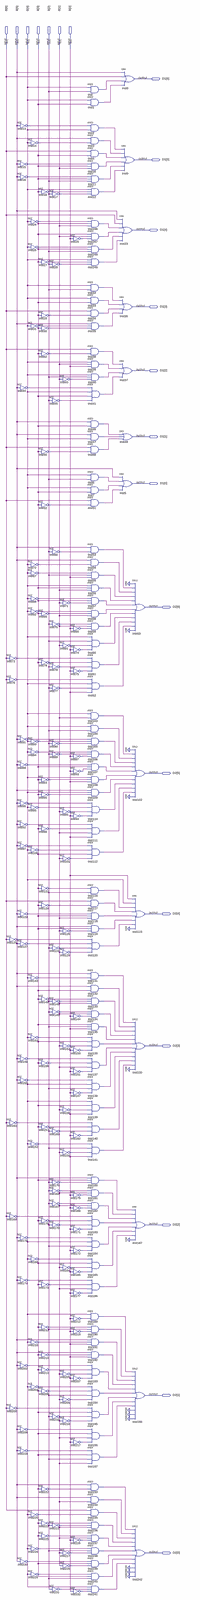
[diagram p0: schematic sheet, whole]
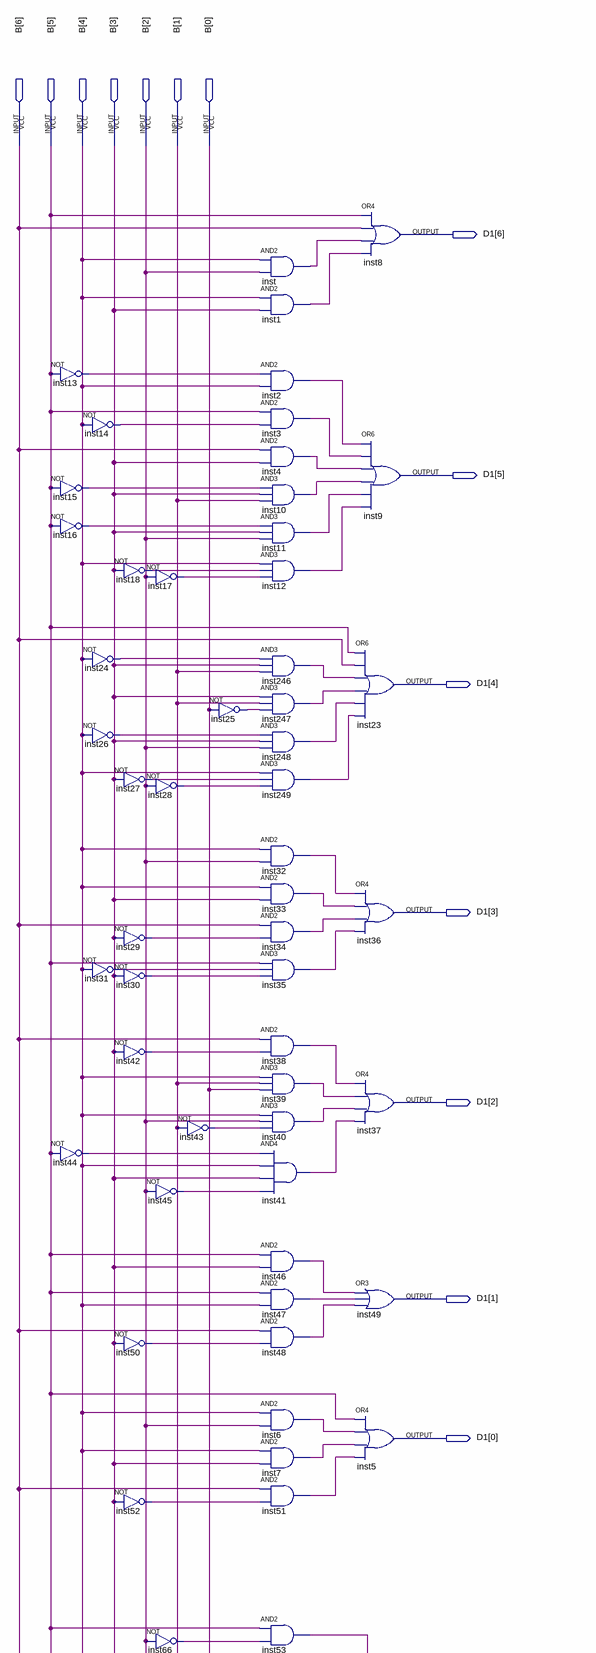
[diagram p1: schematic sheet, upper part]
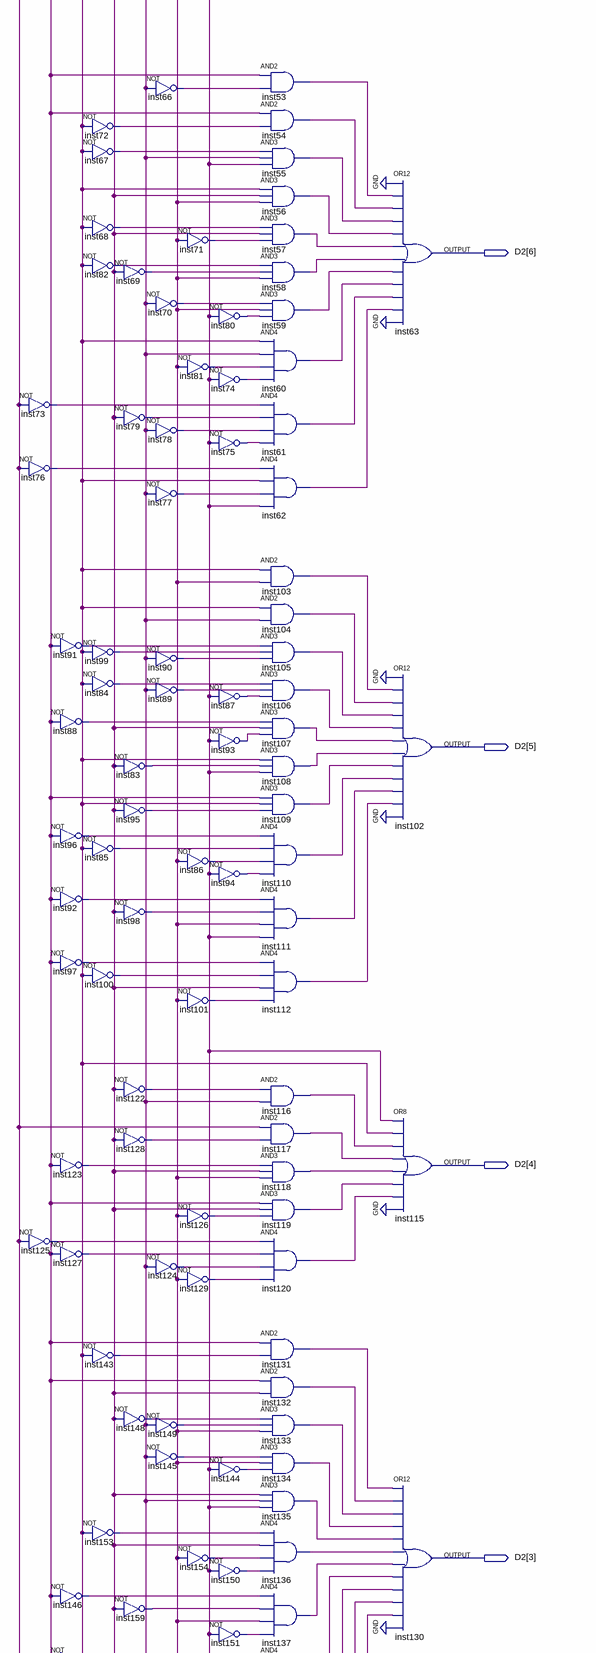
[diagram p2: schematic sheet, middle part]
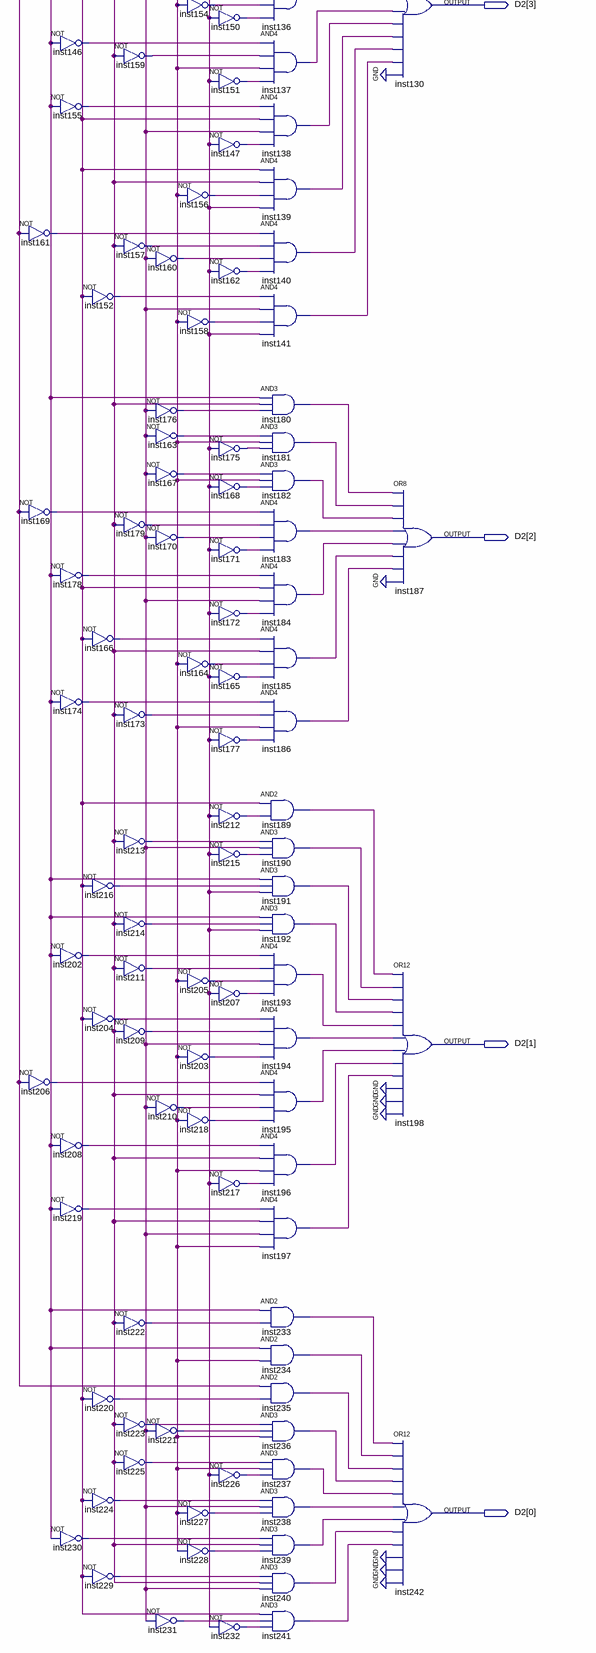
[diagram p3: schematic sheet, lower part]
// Quartus schematic BlockTABELINEA.bdf as structural Verilog: 233 symbols, 21 pins
module BlockTABELINEA (
  input  [6:0] B,
  output [6:0] D1,
  output [6:0] D2
);

  wire inst1_out, inst2_out, inst3_out, inst4_out, inst6_out, inst7_out, inst10_out, inst11_out, inst12_out,
       inst13_out, inst14_out, inst15_out, inst16_out, inst17_out, inst18_out, inst24_out, inst25_out,
       inst26_out, inst27_out, inst28_out, inst29_out, inst30_out, inst31_out, inst32_out, inst33_out,
       inst34_out, inst35_out, inst38_out, inst39_out, inst40_out, inst41_out, inst42_out, inst43_out,
       inst44_out, inst45_out, inst46_out, inst47_out, inst48_out, inst50_out, inst51_out, inst52_out,
       inst53_out, inst54_out, inst55_out, inst56_out, inst57_out, inst58_out, inst59_out, inst60_out,
       inst61_out, inst62_out, inst66_out, inst67_out, inst68_out, inst69_out, inst70_out, inst71_out,
       inst72_out, inst73_out, inst74_out, inst75_out, inst76_out, inst77_out, inst78_out, inst79_out,
       inst80_out, inst81_out, inst82_out, inst83_out, inst84_out, inst85_out, inst86_out, inst87_out,
       inst88_out, inst89_out, inst90_out, inst91_out, inst92_out, inst93_out, inst94_out, inst95_out,
       inst96_out, inst97_out, inst98_out, inst99_out, inst100_out, inst101_out, inst103_out, inst104_out,
       inst105_out, inst106_out, inst107_out, inst108_out, inst109_out, inst110_out, inst111_out,
       inst112_out, inst116_out, inst117_out, inst118_out, inst119_out, inst120_out, inst122_out,
       inst123_out, inst124_out, inst125_out, inst126_out, inst127_out, inst128_out, inst129_out,
       inst131_out, inst132_out, inst133_out, inst134_out, inst135_out, inst136_out, inst137_out,
       inst138_out, inst139_out, inst140_out, inst141_out, inst143_out, inst144_out, inst145_out,
       inst146_out, inst147_out, inst148_out, inst149_out, inst150_out, inst151_out, inst152_out,
       inst153_out, inst154_out, inst155_out, inst156_out, inst157_out, inst158_out, inst159_out,
       inst160_out, inst161_out, inst162_out, inst163_out, inst164_out, inst165_out, inst166_out,
       inst167_out, inst168_out, inst169_out, inst170_out, inst171_out, inst172_out, inst173_out,
       inst174_out, inst175_out, inst176_out, inst177_out, inst178_out, inst179_out, inst180_out,
       inst181_out, inst182_out, inst183_out, inst184_out, inst185_out, inst186_out, inst189_out,
       inst190_out, inst191_out, inst192_out, inst193_out, inst194_out, inst195_out, inst196_out,
       inst197_out, inst202_out, inst203_out, inst204_out, inst205_out, inst206_out, inst207_out,
       inst208_out, inst209_out, inst210_out, inst211_out, inst212_out, inst213_out, inst214_out,
       inst215_out, inst216_out, inst217_out, inst218_out, inst219_out, inst220_out, inst221_out,
       inst222_out, inst223_out, inst224_out, inst225_out, inst226_out, inst227_out, inst228_out,
       inst229_out, inst230_out, inst231_out, inst232_out, inst233_out, inst234_out, inst235_out,
       inst236_out, inst237_out, inst238_out, inst239_out, inst240_out, inst241_out, inst246_out,
       inst247_out, inst248_out, inst249_out, inst_out;

  not inst13 (inst13_out, B[5]);
  not inst15 (inst15_out, B[5]);
  not inst16 (inst16_out, B[5]);
  not inst44 (inst44_out, B[5]);
  not inst73 (inst73_out, B[6]);
  not inst76 (inst76_out, B[6]);
  not inst91 (inst91_out, B[5]);
  not inst88 (inst88_out, B[5]);
  not inst96 (inst96_out, B[5]);
  not inst92 (inst92_out, B[5]);
  not inst97 (inst97_out, B[5]);
  not inst123 (inst123_out, B[5]);
  not inst125 (inst125_out, B[6]);
  not inst127 (inst127_out, B[5]);
  not inst146 (inst146_out, B[5]);
  not inst155 (inst155_out, B[5]);
  not inst161 (inst161_out, B[6]);
  not inst169 (inst169_out, B[6]);
  not inst178 (inst178_out, B[5]);
  not inst174 (inst174_out, B[5]);
  not inst202 (inst202_out, B[5]);
  not inst206 (inst206_out, B[6]);
  not inst208 (inst208_out, B[5]);
  not inst219 (inst219_out, B[5]);
  not inst230 (inst230_out, B[5]);
  not inst14 (inst14_out, B[4]);
  not inst24 (inst24_out, B[4]);
  not inst26 (inst26_out, B[4]);
  not inst31 (inst31_out, B[4]);
  not inst72 (inst72_out, B[4]);
  not inst67 (inst67_out, B[4]);
  not inst68 (inst68_out, B[4]);
  not inst82 (inst82_out, B[4]);
  not inst99 (inst99_out, B[4]);
  not inst84 (inst84_out, B[4]);
  not inst85 (inst85_out, B[4]);
  not inst100 (inst100_out, B[4]);
  not inst143 (inst143_out, B[4]);
  not inst153 (inst153_out, B[4]);
  not inst152 (inst152_out, B[4]);
  not inst166 (inst166_out, B[4]);
  not inst216 (inst216_out, B[4]);
  not inst204 (inst204_out, B[4]);
  not inst220 (inst220_out, B[4]);
  not inst224 (inst224_out, B[4]);
  not inst229 (inst229_out, B[4]);
  not inst18 (inst18_out, B[3]);
  not inst17 (inst17_out, B[2]);
  not inst27 (inst27_out, B[3]);
  not inst28 (inst28_out, B[2]);
  not inst29 (inst29_out, B[3]);
  not inst30 (inst30_out, B[3]);
  not inst42 (inst42_out, B[3]);
  not inst45 (inst45_out, B[2]);
  not inst50 (inst50_out, B[3]);
  not inst52 (inst52_out, B[3]);
  not inst66 (inst66_out, B[2]);
  not inst69 (inst69_out, B[3]);
  not inst70 (inst70_out, B[2]);
  not inst79 (inst79_out, B[3]);
  not inst78 (inst78_out, B[2]);
  not inst77 (inst77_out, B[2]);
  not inst90 (inst90_out, B[2]);
  not inst89 (inst89_out, B[2]);
  not inst83 (inst83_out, B[3]);
  not inst95 (inst95_out, B[3]);
  not inst98 (inst98_out, B[3]);
  not inst122 (inst122_out, B[3]);
  not inst128 (inst128_out, B[3]);
  not inst124 (inst124_out, B[2]);
  not inst148 (inst148_out, B[3]);
  not inst149 (inst149_out, B[2]);
  not inst145 (inst145_out, B[2]);
  not inst159 (inst159_out, B[3]);
  not inst157 (inst157_out, B[3]);
  not inst160 (inst160_out, B[2]);
  not inst176 (inst176_out, B[2]);
  not inst163 (inst163_out, B[2]);
  not inst167 (inst167_out, B[2]);
  not inst179 (inst179_out, B[3]);
  not inst170 (inst170_out, B[2]);
  not inst173 (inst173_out, B[3]);
  not inst213 (inst213_out, B[3]);
  not inst214 (inst214_out, B[3]);
  not inst211 (inst211_out, B[3]);
  not inst209 (inst209_out, B[3]);
  not inst210 (inst210_out, B[2]);
  not inst222 (inst222_out, B[3]);
  not inst223 (inst223_out, B[3]);
  not inst221 (inst221_out, B[2]);
  not inst225 (inst225_out, B[3]);
  not inst231 (inst231_out, B[2]);
  not inst43 (inst43_out, B[1]);
  not inst71 (inst71_out, B[1]);
  not inst81 (inst81_out, B[1]);
  not inst86 (inst86_out, B[1]);
  not inst101 (inst101_out, B[1]);
  not inst126 (inst126_out, B[1]);
  not inst129 (inst129_out, B[1]);
  not inst154 (inst154_out, B[1]);
  not inst156 (inst156_out, B[1]);
  not inst158 (inst158_out, B[1]);
  not inst164 (inst164_out, B[1]);
  not inst205 (inst205_out, B[1]);
  not inst203 (inst203_out, B[1]);
  not inst218 (inst218_out, B[1]);
  not inst227 (inst227_out, B[1]);
  not inst228 (inst228_out, B[1]);
  not inst25 (inst25_out, B[0]);
  not inst80 (inst80_out, B[0]);
  not inst74 (inst74_out, B[0]);
  not inst75 (inst75_out, B[0]);
  not inst87 (inst87_out, B[0]);
  not inst93 (inst93_out, B[0]);
  not inst94 (inst94_out, B[0]);
  not inst144 (inst144_out, B[0]);
  not inst150 (inst150_out, B[0]);
  not inst151 (inst151_out, B[0]);
  not inst147 (inst147_out, B[0]);
  not inst162 (inst162_out, B[0]);
  not inst175 (inst175_out, B[0]);
  not inst168 (inst168_out, B[0]);
  not inst171 (inst171_out, B[0]);
  not inst172 (inst172_out, B[0]);
  not inst165 (inst165_out, B[0]);
  not inst177 (inst177_out, B[0]);
  not inst212 (inst212_out, B[0]);
  not inst215 (inst215_out, B[0]);
  not inst207 (inst207_out, B[0]);
  not inst217 (inst217_out, B[0]);
  not inst226 (inst226_out, B[0]);
  not inst232 (inst232_out, B[0]);
  and inst (inst_out, B[4], B[2]);
  and inst1 (inst1_out, B[4], B[3]);
  and inst2 (inst2_out, inst13_out, B[4]);
  and inst3 (inst3_out, B[5], inst14_out);
  and inst4 (inst4_out, B[6], B[3]);
  and inst10 (inst10_out, inst15_out, B[3], B[1]);
  and inst11 (inst11_out, inst16_out, B[3], B[2]);
  and inst12 (inst12_out, B[4], inst18_out, inst17_out);
  and inst246 (inst246_out, inst24_out, B[3], B[1]);
  and inst247 (inst247_out, B[3], B[1], inst25_out);
  and inst248 (inst248_out, inst26_out, B[3], B[2]);
  and inst249 (inst249_out, B[4], inst27_out, inst28_out);
  and inst32 (inst32_out, B[4], B[2]);
  and inst33 (inst33_out, B[4], B[3]);
  and inst34 (inst34_out, B[6], inst29_out);
  and inst35 (inst35_out, B[5], inst31_out, inst30_out);
  and inst38 (inst38_out, B[6], inst42_out);
  and inst39 (inst39_out, B[4], B[1], B[0]);
  and inst40 (inst40_out, B[4], B[2], inst43_out);
  and inst41 (inst41_out, inst44_out, B[4], B[3], inst45_out);
  and inst46 (inst46_out, B[5], B[3]);
  and inst47 (inst47_out, B[5], B[4]);
  and inst48 (inst48_out, B[6], inst50_out);
  and inst6 (inst6_out, B[4], B[2]);
  and inst7 (inst7_out, B[4], B[3]);
  and inst51 (inst51_out, B[6], inst52_out);
  and inst53 (inst53_out, B[5], inst66_out);
  and inst54 (inst54_out, B[5], inst72_out);
  and inst55 (inst55_out, inst67_out, B[2], B[0]);
  and inst56 (inst56_out, B[4], B[3], B[1]);
  and inst57 (inst57_out, inst68_out, B[3], inst71_out);
  and inst58 (inst58_out, inst82_out, inst69_out, B[1]);
  and inst59 (inst59_out, inst70_out, B[1], inst80_out);
  and inst60 (inst60_out, B[4], B[2], inst81_out, inst74_out);
  and inst61 (inst61_out, inst73_out, inst79_out, inst78_out, inst75_out);
  and inst62 (inst62_out, inst76_out, B[4], inst77_out, B[0]);
  and inst103 (inst103_out, B[4], B[1]);
  and inst104 (inst104_out, B[4], B[2]);
  and inst105 (inst105_out, inst91_out, inst99_out, inst90_out);
  and inst106 (inst106_out, inst84_out, inst89_out, inst87_out);
  and inst107 (inst107_out, inst88_out, B[3], inst93_out);
  and inst108 (inst108_out, B[4], inst83_out, B[0]);
  and inst109 (inst109_out, B[5], B[4], inst95_out);
  and inst110 (inst110_out, inst96_out, inst85_out, inst86_out, inst94_out);
  and inst111 (inst111_out, inst92_out, inst98_out, B[1], B[0]);
  and inst112 (inst112_out, inst97_out, inst100_out, B[3], inst101_out);
  and inst116 (inst116_out, inst122_out, B[2]);
  and inst117 (inst117_out, B[6], inst128_out);
  and inst118 (inst118_out, inst123_out, B[3], B[1]);
  and inst119 (inst119_out, B[5], B[3], inst126_out);
  and inst120 (inst120_out, inst125_out, inst127_out, inst124_out, inst129_out);
  and inst131 (inst131_out, B[5], inst143_out);
  and inst132 (inst132_out, B[5], B[3]);
  and inst133 (inst133_out, inst148_out, inst149_out, B[1]);
  and inst134 (inst134_out, inst145_out, B[1], inst144_out);
  and inst135 (inst135_out, B[3], B[2], B[0]);
  and inst136 (inst136_out, inst153_out, B[3], inst154_out, inst150_out);
  and inst137 (inst137_out, inst146_out, inst159_out, B[1], inst151_out);
  and inst138 (inst138_out, inst155_out, B[4], B[2], inst147_out);
  and inst139 (inst139_out, B[4], B[3], inst156_out, B[0]);
  and inst140 (inst140_out, inst161_out, inst157_out, inst160_out, inst162_out);
  and inst141 (inst141_out, inst152_out, B[2], inst158_out, B[0]);
  and inst180 (inst180_out, B[5], B[3], inst176_out);
  and inst181 (inst181_out, inst163_out, B[1], inst175_out);
  and inst182 (inst182_out, inst167_out, B[1], inst168_out);
  and inst183 (inst183_out, inst169_out, inst179_out, inst170_out, inst171_out);
  and inst184 (inst184_out, inst178_out, B[4], B[2], inst172_out);
  and inst185 (inst185_out, inst166_out, B[3], inst164_out, inst165_out);
  and inst186 (inst186_out, inst174_out, inst173_out, B[1], inst177_out);
  and inst189 (inst189_out, B[4], inst212_out);
  and inst190 (inst190_out, inst213_out, B[2], inst215_out);
  and inst191 (inst191_out, B[5], inst216_out, B[0]);
  and inst192 (inst192_out, B[5], inst214_out, B[0]);
  and inst193 (inst193_out, inst202_out, inst211_out, inst205_out, inst207_out);
  and inst194 (inst194_out, inst204_out, inst209_out, B[2], inst203_out);
  and inst195 (inst195_out, inst206_out, B[3], inst210_out, inst218_out);
  and inst196 (inst196_out, inst208_out, B[3], B[1], inst217_out);
  and inst197 (inst197_out, inst219_out, B[3], B[2], B[1]);
  and inst233 (inst233_out, B[5], inst222_out);
  and inst234 (inst234_out, B[5], B[1]);
  and inst235 (inst235_out, B[6], inst220_out);
  and inst236 (inst236_out, inst223_out, inst221_out, B[1]);
  and inst237 (inst237_out, inst225_out, B[1], inst226_out);
  and inst238 (inst238_out, inst224_out, B[2], inst227_out);
  and inst239 (inst239_out, inst230_out, B[3], inst228_out);
  and inst240 (inst240_out, inst229_out, B[3], B[2]);
  and inst241 (inst241_out, B[4], inst231_out, inst232_out);
  or inst23 (D1[4], B[5], B[6], inst246_out, inst247_out, inst248_out, inst249_out);
  or inst36 (D1[3], inst32_out, inst33_out, inst34_out, inst35_out);
  or inst37 (D1[2], inst38_out, inst39_out, inst40_out, inst41_out);
  or inst49 (D1[1], inst46_out, inst47_out, inst48_out);
  or inst5 (D1[0], B[5], inst6_out, inst7_out, inst51_out);
  or inst8 (D1[6], B[5], B[6], inst_out, inst1_out);
  or inst9 (D1[5], inst2_out, inst3_out, inst4_out, inst10_out, inst11_out, inst12_out);
  or inst63 (D2[6], 1'b0, inst53_out, inst54_out, inst55_out, inst56_out, inst57_out, inst58_out, inst59_out, inst60_out, inst61_out, inst62_out, 1'b0);
  or inst102 (D2[5], 1'b0, inst103_out, inst104_out, inst105_out, inst106_out, inst107_out, inst108_out, inst109_out, inst110_out, inst111_out, inst112_out, 1'b0);
  or inst115 (D2[4], B[0], B[4], inst116_out, inst117_out, inst118_out, inst119_out, inst120_out, 1'b0);
  or inst130 (D2[3], inst131_out, inst132_out, inst133_out, inst134_out, inst135_out, inst136_out, inst137_out, inst138_out, inst139_out, inst140_out, inst141_out, 1'b0);
  or inst187 (D2[2], inst180_out, inst181_out, inst182_out, inst183_out, inst184_out, inst185_out, inst186_out, 1'b0);
  or inst198 (D2[1], inst189_out, inst190_out, inst191_out, inst192_out, inst193_out, inst194_out, inst195_out, inst196_out, inst197_out, 1'b0, 1'b0, 1'b0);
  or inst242 (D2[0], inst233_out, inst234_out, inst235_out, inst236_out, inst237_out, inst238_out, inst239_out, inst240_out, inst241_out, 1'b0, 1'b0, 1'b0);
endmodule
